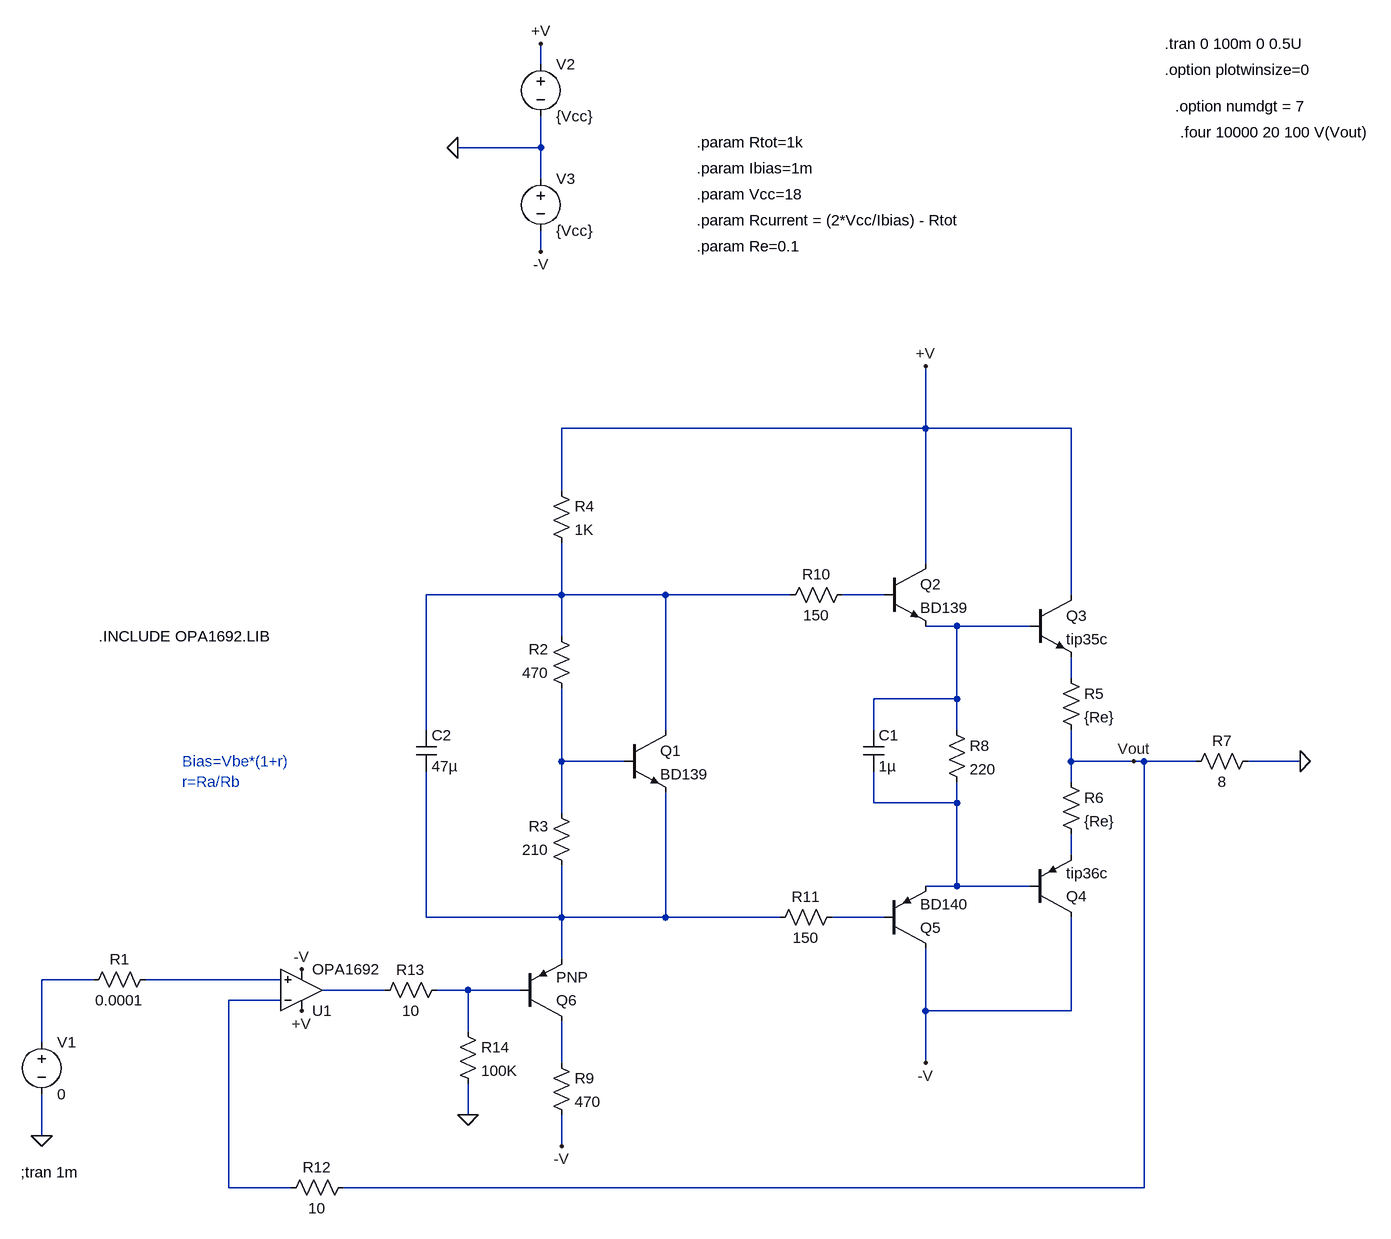
[diagram p0: schematic V1 DC.asc]
V1 DC.asc, the LTspice schematic file:
Version 4
SHEET 1 880 1284
WIRE -512 -624 -512 -656
WIRE -512 -496 -512 -544
WIRE -512 -496 -640 -496
WIRE -512 -448 -512 -496
WIRE -512 -336 -512 -368
WIRE 80 -64 80 -160
WIRE 80 -64 -480 -64
WIRE 304 -64 80 -64
WIRE -480 32 -480 -64
WIRE 80 144 80 -64
WIRE -480 192 -480 112
WIRE -480 192 -688 192
WIRE -320 192 -480 192
WIRE -128 192 -320 192
WIRE 16 192 -48 192
WIRE 304 192 304 -64
WIRE 128 240 80 240
WIRE 240 240 128 240
WIRE -480 256 -480 192
WIRE 304 320 304 288
WIRE 128 352 128 240
WIRE 128 352 0 352
WIRE -688 400 -688 192
WIRE -320 400 -320 192
WIRE 0 400 0 352
WIRE 128 400 128 352
WIRE -480 448 -480 336
WIRE -384 448 -480 448
WIRE 304 448 304 400
WIRE 400 448 304 448
WIRE 416 448 400 448
WIRE 496 448 416 448
WIRE 656 448 576 448
WIRE 304 480 304 448
WIRE 0 512 0 464
WIRE 128 512 128 480
WIRE 128 512 0 512
WIRE -480 528 -480 448
WIRE 304 592 304 560
WIRE 128 640 128 512
WIRE 128 640 80 640
WIRE 240 640 128 640
WIRE -688 688 -688 464
WIRE -480 688 -480 608
WIRE -480 688 -688 688
WIRE -320 688 -320 496
WIRE -320 688 -480 688
WIRE -144 688 -320 688
WIRE 16 688 -64 688
WIRE -480 752 -480 688
WIRE -1200 784 -1280 784
WIRE -912 784 -1120 784
WIRE -752 800 -848 800
WIRE -624 800 -672 800
WIRE -544 800 -624 800
WIRE -912 816 -992 816
WIRE 80 832 80 736
WIRE 304 832 304 688
WIRE 304 832 80 832
WIRE -624 864 -624 800
WIRE -1280 880 -1280 784
WIRE -480 912 -480 848
WIRE 80 912 80 832
WIRE -624 992 -624 944
WIRE -1280 1024 -1280 960
WIRE -480 1040 -480 992
WIRE -992 1104 -992 816
WIRE -896 1104 -992 1104
WIRE 416 1104 416 448
WIRE 416 1104 -816 1104
FLAG 80 -160 +V
FLAG 80 912 -V
FLAG -1280 1024 0
FLAG -640 -496 0
FLAG -512 -656 +V
FLAG -512 -336 -V
FLAG 656 448 0
FLAG 400 448 Vout
FLAG -480 1040 -V
FLAG -880 832 +V
FLAG -880 768 -V
FLAG -624 992 0
SYMBOL voltage -1280 864 R0
WINDOW 123 0 0 Left 0
WINDOW 39 0 0 Left 0
SYMATTR InstName V1
SYMATTR Value 0
SYMBOL res -1104 768 R90
WINDOW 0 0 56 VBottom 2
WINDOW 3 32 56 VTop 2
SYMATTR InstName R1
SYMATTR Value 0.0001
SYMBOL res -464 352 R180
WINDOW 0 36 76 Left 2
WINDOW 3 36 40 Left 2
SYMATTR InstName R2
SYMATTR Value 470
SYMBOL res -464 624 R180
WINDOW 0 36 76 Left 2
WINDOW 3 36 40 Left 2
SYMATTR InstName R3
SYMATTR Value 210
SYMBOL npn -384 400 R0
SYMATTR InstName Q1
SYMATTR Value BD139
SYMBOL npn 16 144 R0
SYMATTR InstName Q2
SYMATTR Value BD139
SYMBOL npn 240 192 R0
SYMATTR InstName Q3
SYMATTR Value tip35c
SYMBOL res -496 16 R0
SYMATTR InstName R4
SYMATTR Value 1K
SYMBOL pnp 240 688 M180
SYMATTR InstName Q4
SYMATTR Value tip36c
SYMBOL pnp 16 736 M180
SYMATTR InstName Q5
SYMATTR Value BD140
SYMBOL res 288 304 R0
SYMATTR InstName R5
SYMATTR Value {Re}
SYMBOL res 288 464 R0
SYMATTR InstName R6
SYMATTR Value {Re}
SYMBOL voltage -512 -640 R0
WINDOW 123 0 0 Left 0
WINDOW 39 0 0 Left 0
SYMATTR InstName V2
SYMATTR Value {Vcc}
SYMBOL voltage -512 -464 R0
WINDOW 123 0 0 Left 0
WINDOW 39 0 0 Left 0
SYMATTR InstName V3
SYMATTR Value {Vcc}
SYMBOL res 592 432 R90
WINDOW 0 0 56 VBottom 2
WINDOW 3 32 56 VTop 2
SYMATTR InstName R7
SYMATTR Value 8
SYMBOL res -32 176 R90
WINDOW 0 0 56 VBottom 2
WINDOW 3 32 56 VTop 2
SYMATTR InstName R10
SYMATTR Value 150
SYMBOL res -48 672 R90
WINDOW 0 0 56 VBottom 2
WINDOW 3 32 56 VTop 2
SYMATTR InstName R11
SYMATTR Value 150
SYMBOL res 112 384 R0
SYMATTR InstName R8
SYMATTR Value 220
SYMBOL cap -16 400 R0
SYMATTR InstName C1
SYMATTR Value 1µ
SYMBOL res -496 896 R0
SYMATTR InstName R9
SYMATTR Value 470
SYMBOL cap -704 400 R0
SYMATTR InstName C2
SYMATTR Value 47µ
SYMBOL OpAmps\\opamp2 -880 864 M180
SYMATTR InstName U1
SYMATTR Value OPA1692
SYMBOL res -800 1088 R90
WINDOW 0 0 56 VBottom 2
WINDOW 3 32 56 VTop 2
SYMATTR InstName R12
SYMATTR Value 10
SYMBOL res -656 784 R90
WINDOW 0 0 56 VBottom 2
WINDOW 3 32 56 VTop 2
SYMATTR InstName R13
SYMATTR Value 10
SYMBOL res -640 848 R0
SYMATTR InstName R14
SYMATTR Value 100K
SYMBOL pnp -544 848 M180
SYMATTR InstName Q6
TEXT -1064 448 Left 2 ;Bias=Vbe*(1+r)\nr=Ra/Rb
TEXT -272 -504 Left 2 !.param Rtot=1k
TEXT -272 -464 Left 2 !.param Ibias=1m
TEXT -272 -424 Left 2 !.param Vcc=18
TEXT -272 -384 Left 2 !.param Rcurrent = (2*Vcc/Ibias) - Rtot
TEXT -272 -344 Left 2 !.param Re=0.1
TEXT -1312 1080 Left 2 !;tran 1m
TEXT 448 -656 Left 2 !.tran 0 100m 0 0.5U
TEXT 448 -616 Left 2 !.option plotwinsize=0
TEXT 464 -560 Left 2 !.option numdgt = 7
TEXT 472 -520 Left 2 !.four 10000 20 100 V(Vout)
TEXT -1192 256 Left 2 !.INCLUDE OPA1692.LIB

The netlist it stands for:
* V1 DC.asc
V1 N010 0 0
R1 N011 N010 0.0001
R2 N005 N001 470
R3 N008 N005 210
Q1 N001 N005 N008 0 BD139
Q2 +V N002 N003 0 BD139
Q3 +V N003 N004 0 tip35c
R4 +V N001 1K
Q4 -V N006 N007 0 tip36c
Q5 -V N009 N006 0 BD140
R5 N004 Vout {Re}
R6 Vout N007 {Re}
V2 +V 0 {Vcc}
V3 0 -V {Vcc}
R7 0 Vout 8
R10 N002 N001 150
R11 N009 N008 150
R8 N003 N006 220
C1 N003 N006 1µ
R9 N015 -V 470
C2 N001 N008 47µ
XU1 N011 N014 +V -V N012 OPA1692  ; pins In+ In- V+ V- OUT
R12 Vout N014 10
R13 N013 N012 10
R14 N013 0 100K
Q6 N015 N013 N008 0 PNP
.model NPN NPN
.model PNP PNP
.lib standard.bjt
* Bias=Vbe*(1+r)
* r=Ra/Rb
.param Rtot=1k
.param Ibias=1m
.param Vcc=18
.param Rcurrent = (2*Vcc/Ibias) - Rtot
.param Re=0.1
;tran 1m
.tran 0 100m 0 0.5U
.option plotwinsize=0
.option numdgt = 7
.four 10000 20 100 V(Vout)
.INCLUDE OPA1692.LIB
.backanno
.end